# Altium schematic sheet STORAGE.SchDoc
size C
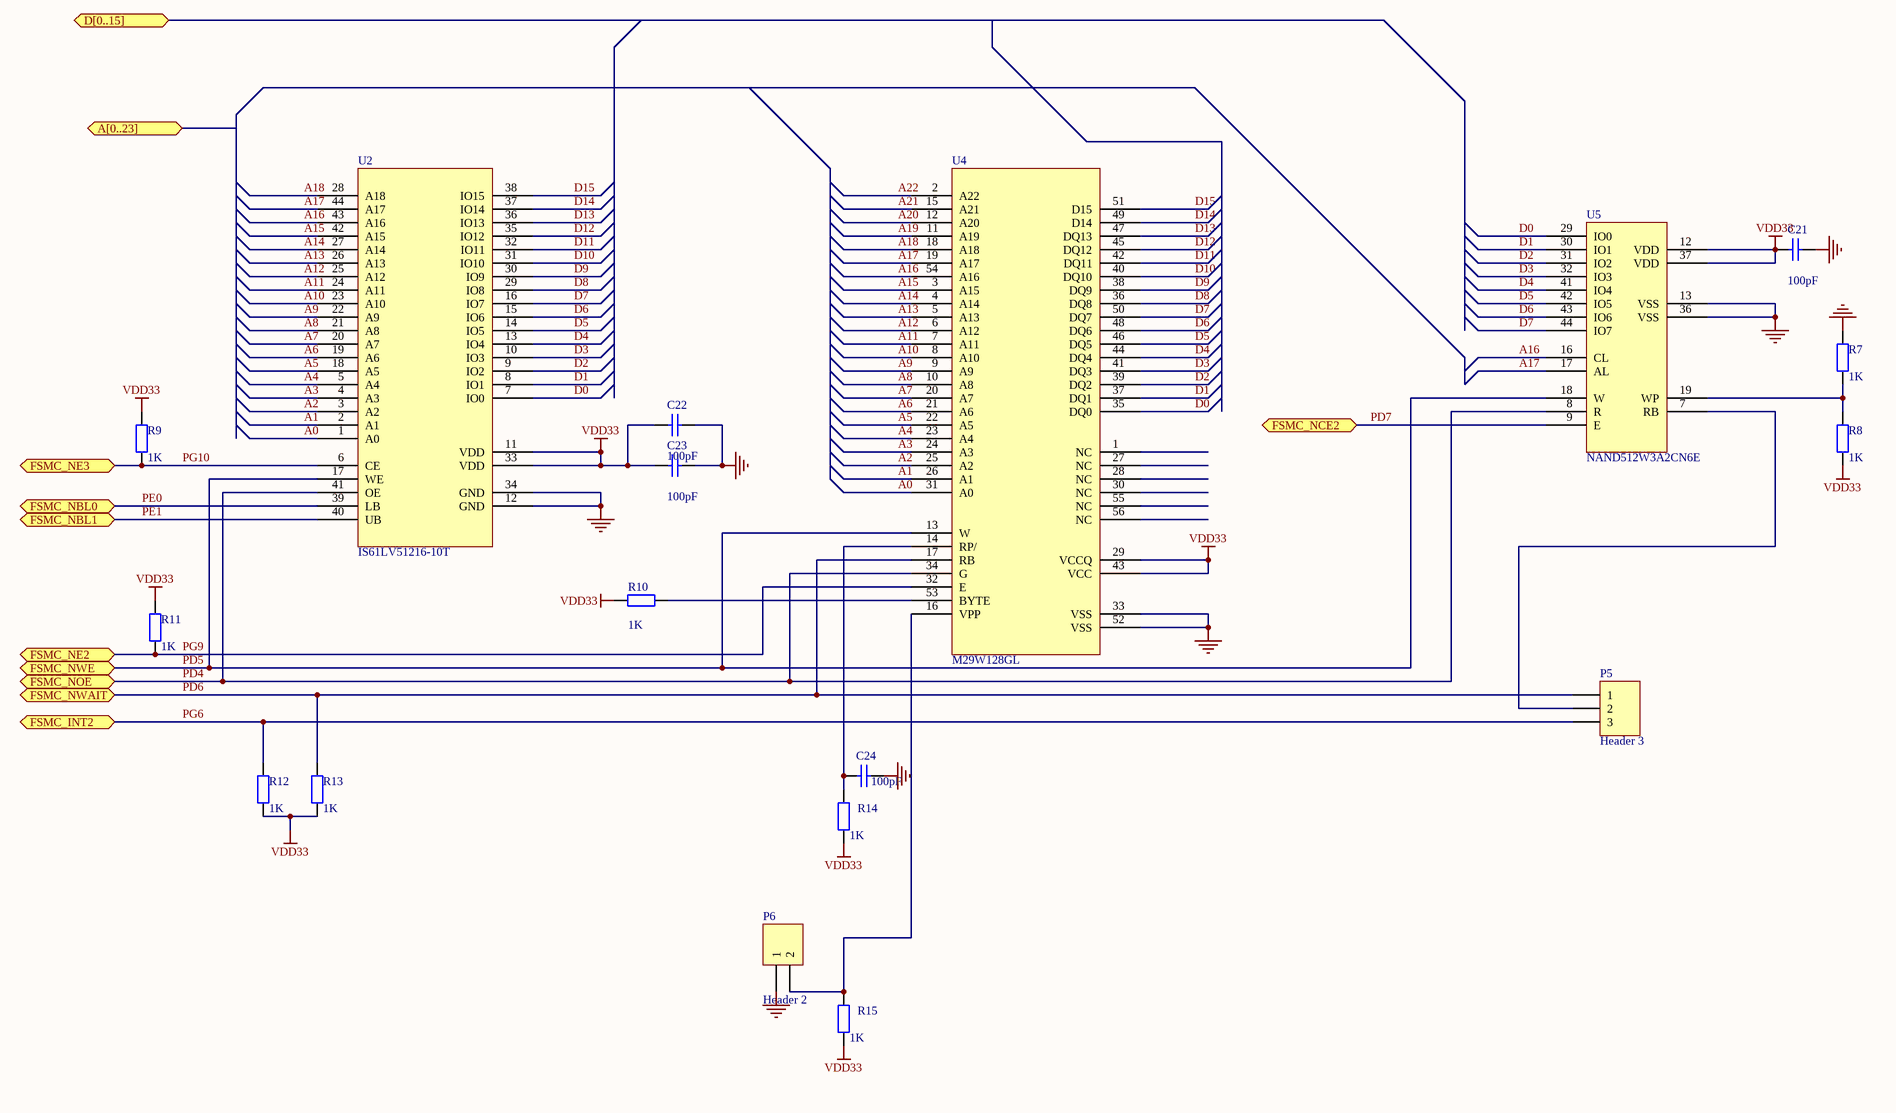
[diagram p0: STORAGE.SchDoc]

## Parts
C21  value 100pF  [0805]  (hidden comment: Cap)
C22  value 100pF  [0805]  (hidden comment: Cap)
C23  value 100pF  [0805]  (hidden comment: Cap)
C24  value 100pF  [0805]  (hidden comment: Cap)
P5  Header 3  [HDR1X3]
P6  Header 2  [HDR1X2]
R7  value 1K  [0805]  (hidden comment: Res2)
R8  value 1K  [0805]  (hidden comment: Res2)
R9  value 1K  [0805]  (hidden comment: Res2)
R10  value 1K  [0805]  (hidden comment: Res2)
R11  value 1K  [0805]  (hidden comment: Res2)
R12  value 1K  [0805]  (hidden comment: Res2)
R13  value 1K  [0805]  (hidden comment: Res2)
R14  value 1K  [0805]  (hidden comment: Res2)
R15  value 1K  [0805]  (hidden comment: Res2)
U2  IS61LV51216-10T  [TSOP44]
U4  M29W128GL  [TSOP56]
U5  NAND512W3A2CN6E  [TSOP48]

## Ports
A[0..23] (bidir), D[0..15] (bidir), FSMC_INT2 (bidir), FSMC_NBL0 (bidir), FSMC_NBL1 (bidir), FSMC_NCE2 (bidir), FSMC_NE2 (bidir), FSMC_NE3 (bidir), FSMC_NOE (bidir), FSMC_NWAIT (bidir), FSMC_NWE (bidir)

## Nets
GND: C21.2 C22.2 C23.2 C24.2 P6.1 R7.2 U2.12(GND) U2.34(GND) U4.33(VSS) U4.52(VSS) U5.13(VSS) U5.36(VSS)
VDD33: C21.1 C22.1 C23.1 R8.1 R9.2 R10.2 R11.2 R12.2 R13.1 R14.1 R15.1 U2.11(VDD) U2.33(VDD) U4.29(VCCQ) U4.43(VCC) U5.12(VDD) U5.37(VDD)
A0: U2.1(A0) U4.31(A0)
A1: U2.2(A1) U4.26(A1)
A2: U2.3(A2) U4.25(A2)
A3: U2.4(A3) U4.24(A3)
A4: U2.5(A4) U4.23(A4)
A5: U2.18(A5) U4.22(A5)
A6: U2.19(A6) U4.21(A6)
A7: U2.20(A7) U4.20(A7)
A8: U2.21(A8) U4.10(A8)
A9: U2.22(A9) U4.9(A9)
A10: U2.23(A10) U4.8(A10)
A11: U2.24(A11) U4.7(A11)
A12: U2.25(A12) U4.6(A12)
A13: U2.26(A13) U4.5(A13)
A14: U2.27(A14) U4.4(A14)
A15: U2.42(A15) U4.3(A15)
A16: U2.43(A16) U4.54(A16) U5.16(CL)
A17: U2.44(A17) U4.19(A17) U5.17(AL)
A18: U2.28(A18) U4.18(A18)
A19: U4.11(A19)
A20: U4.12(A20)
A21: U4.15(A21)
A22: U4.2(A22)
D0: U2.7(IO0) U4.35(DQ0) U5.29(IO0)
D1: U2.8(IO1) U4.37(DQ1) U5.30(IO1)
D2: U2.9(IO2) U4.39(DQ2) U5.31(IO2)
D3: U2.10(IO3) U4.41(DQ3) U5.32(IO3)
D4: U2.13(IO4) U4.44(DQ4) U5.41(IO4)
D5: U2.14(IO5) U4.46(DQ5) U5.42(IO5)
D6: U2.15(IO6) U4.48(DQ6) U5.43(IO6)
D7: U2.16(IO7) U4.50(DQ7) U5.44(IO7)
D8: U2.29(IO8) U4.36(DQ8)
D9: U2.30(IO9) U4.38(DQ9)
D10: U2.31(IO10) U4.40(DQ10)
D11: U2.32(IO11) U4.42(DQ11)
D12: U2.35(IO12) U4.45(DQ12)
D13: U2.36(IO13) U4.47(DQ13)
D14: U2.37(IO14) U4.49(D14)
D15: U2.38(IO15) U4.51(D15)
PD4: U2.41(OE) U4.34(G) U5.8(R) ; port FSMC_NOE
PD5: U2.17(WE) U4.13(W) U5.18(W) ; port FSMC_NWE
PD6: P5.1 R13.2 U4.17(RB) ; port FSMC_NWAIT
PD7: U5.9(E) ; port FSMC_NCE2
PE0: U2.39(LB) ; port FSMC_NBL0
PE1: U2.40(UB) ; port FSMC_NBL1
PG6: P5.3 R12.1 ; port FSMC_INT2
PG9: R11.1 U4.32(E) ; port FSMC_NE2
PG10: R9.1 U2.6(CE) ; port FSMC_NE3
NetC24_1: C24.1 R14.2 U4.14(RP/)
NetP5_2: P5.2 U5.7(RB)
NetP6_2: P6.2 R15.2 U4.16(VPP)
NetR7_1: R7.1 R8.2 U5.19(WP)
NetR10_1: R10.1 U4.53(BYTE)

Not connected (* = marked no-connect by the designer): U4 1(NC) 27(NC) 28(NC) 30(NC) 55(NC) 56(NC)

## Library data of the parts
C21-C24 = Cap: Capacitor; Published: 8-Jun-2000; LatestRevisionDate: 17-Jul-2002; LatestRevisionNote: Re-released for DXP Platform.; PackageReference: RAD-0.3; Publisher: Altium Limited
P5 = Header 3: Header, 3-Pin; LatestRevisionDate: 17-Jul-2002; LatestRevisionNote: Re-released for DXP Platform.; Publisher: Altium Limited
P6 = Header 2: Header, 2-Pin; LatestRevisionDate: 17-Jul-2002; LatestRevisionNote: Re-released for DXP Platform.; Publisher: Altium Limited
R7-R15 = Res2: Resistor; Published: 8-Jun-2000; LatestRevisionDate: 17-Jul-2002; LatestRevisionNote: Re-released for DXP Platform.; PackageReference: AXIAL-0.4; Publisher: Altium Limited